# Altium project PCB_Project.PrjPcb
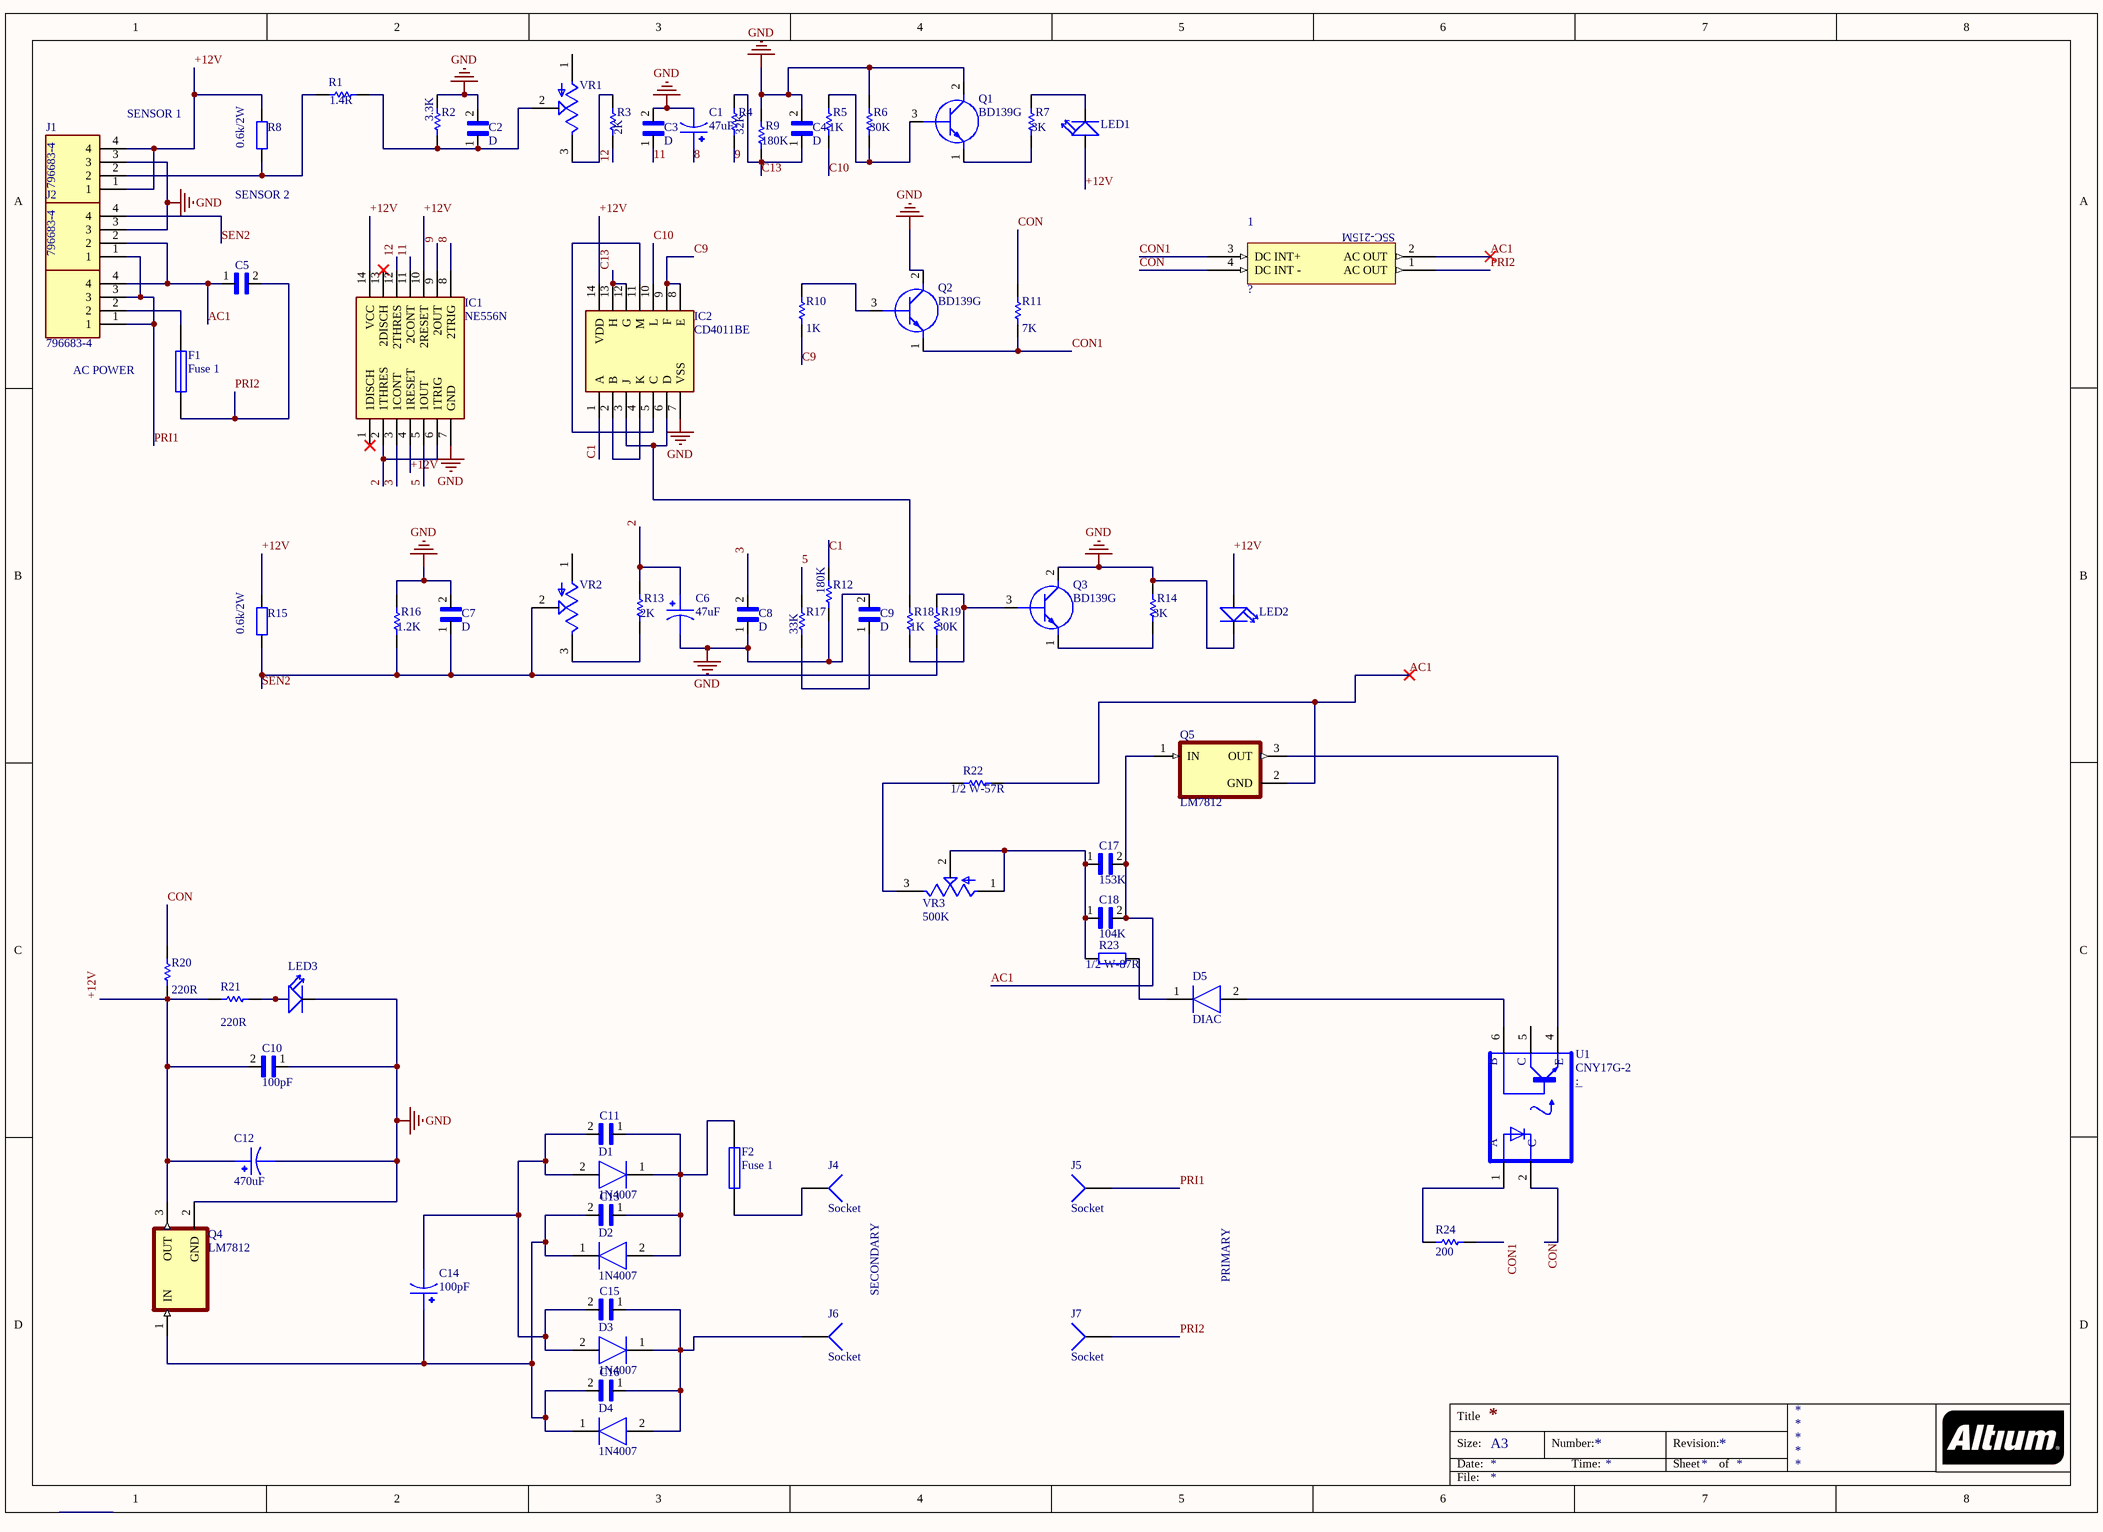
[diagram p0: Sheet1.SchDoc]
1 sheet, 71 parts. Net scope: global (net labels, ports and power ports of the same name join across sheets).
Board file: PCB1.PcbDoc

## Sheet Sheet1.SchDoc
size A3

### Parts
1  ?  [PCBComponent_1]
C1  47uF  [CAPPRD500W60D1330H2700]
C2  D  [CAP_DE21XSA100KN3AY02F]
C3  D  [CAP_DE21XSA100KN3AY02F]
C4  D  [CAP_DE21XSA100KN3AY02F]
C5  (no value)  [CAP_DE21XSA100KN3AY02F]
C6  47uF  [CAPPRD500W60D1330H2700]
C7  D  [CAP_DE21XSA100KN3AY02F]
C8  D  [CAP_DE21XSA100KN3AY02F]
C9  D  [CAP_DE21XSA100KN3AY02F]
C10  100pF  [CAP_DE21XSA100KN3AY02F]
C11  (no value)  [CAP_DE21XSA100KN3AY02F]
C12  470uF  [CAPPRD500W60D1330H2700]
C13  (no value)  [CAP_DE21XSA100KN3AY02F]
C14  100pF  [CAPPRD500W60D1330H2700]
C15  (no value)  [CAP_DE21XSA100KN3AY02F]
C16  (no value)  [CAP_DE21XSA100KN3AY02F]
C17  153K  [CAP_DE21XSA100KN3AY02F]
C18  104K  [CAP_DE21XSA100KN3AY02F]
D1  1N4007  [DIOAD1138W56L406D183]
D2  1N4007  [DIOAD1138W56L406D183]
D3  1N4007  [DIOAD1138W56L406D183]
D4  1N4007  [DIOAD1138W56L406D183]
D5  DIAC  [DIOAD1138W56L406D183]
F1  Fuse 1  [PIN-W2/E2.8]
F2  Fuse 1  [PIN-W2/E2.8]
IC1  NE556N  [DIP794W53P254L1930H508Q14N]
IC2  CD4011BE  [DIP794W53P254L1930H508Q14N]
J1  796683-4  [TE_796683-4]
J2  796683-4  [TE_796683-4]
J3  796683-4  [TE_796683-4]
J4  Socket  [PIN1]
J5  Socket  [PIN1]
J6  Socket  [PIN1]
J7  Socket  [PIN1]
LED1  (no value)  [LED2-2.54-D10MM]
LED2  (no value)  [LED2-2.54-D10MM]
LED3  (no value)  [LED2-2.54-D10MM]
Q1  BD139G  [TO229P300X760X1364-3P]
Q2  BD139G  [TO229P300X760X1364-3P]
Q3  BD139G  [TO229P300X760X1364-3P]
Q4  LM7812  [TO254P1054X470X2600-3]
Q5  LM7812  [TO254P1054X470X2600-3]
R1  value 1.4R  [AXIAL-0.5]
R2  value 3.3K  [AXIAL-0.5]
R3  value 2K  [AXIAL-0.5]
R4  value 32K  [AXIAL-0.5]
R5  value 1K  [AXIAL-0.5]
R6  value 30K  [AXIAL-0.5]
R7  value 3K  [AXIAL-0.5]
R8  value 0.6k/2W  [AXIAL-0.4]
R9  value 180K  [AXIAL-0.5]
R10  value 1K  [AXIAL-0.5]
R11  value 7K  [AXIAL-0.5]
R12  value 180K  [AXIAL-0.5]
R13  value 2K  [AXIAL-0.5]
R14  value 3K  [AXIAL-0.5]
R15  value 0.6k/2W  [AXIAL-0.4]
R16  value 1.2K  [AXIAL-0.5]
R17  value 33K  [AXIAL-0.5]
R18  value 1K  [AXIAL-0.5]
R19  value 30K  [AXIAL-0.5]
R20  value 220R  [AXIAL-0.5]
R21  value 220R  [AXIAL-0.5]
R22  value 1/2 W-57R  [AXIAL-0.5]
R23  value 1/2 W-87R  [AXIAL-0.4]
R24  value 200  [AXIAL-0.5]
U1  CNY17G-2  [DIP762W50P254L730H410Q6]
VR1  (no value)  [TRIM_3362P-1-105]
VR2  (no value)  [TRIM_3362P-1-105]
VR3  500K  [TRIM_3362P-1-105]

### Nets
GND: C1.2 C2.2 C3.2 C4.2 C6.2 C7.2 C8.1 C9.2 C10.1 C12.2 IC1.7(GND) IC2.7(VSS) J1.3 J2.3 LED2.NEG LED3.NEG Q1.2(C) Q2.2(C) Q3.2(C) Q4.2(GND) R2.2 R6.2 R9.2 R12.1 R14.2 R16.2
2: C6.1 IC1.2(1THRES) IC1.6(1TRIG) R13.2
3: C8.2 IC1.3(1CONT)
5: IC1.5(1OUT) R17.2
8: C1.1 IC1.8(2TRIG)
9: IC1.9(2OUT) R4.1
11: C3.1 IC1.11(2CONT)
12: IC1.12(2THRES) R3.1
+12V: C10.2 C12.1 IC1.4(1RESET) IC1.10(2RESET) IC1.14(VCC) IC2.14(VDD) J1.1 J1.4 LED1.POS LED2.POS Q4.3(OUT) R8.2 R15.2 R20.2 R21.2
AC1: 1.2(AC_OUT) C5.1 C17.2 C18.2 J2.2 J3.4 Q5.1(IN) Q5.2(GND) R22.2
C1: IC2.1(A) R12.2
C9: IC2.8(E) IC2.9(F) R10.1
C10: IC2.10(L) R5.1
C13: C4.1 IC2.12(G) IC2.13(H) R4.2 R9.1
CON: 1.4(DC_INT_-) R11.2 R20.1 U1.2(C)
CON1: 1.3(DC_INT+) Q2.1(E) R11.1 R24.1
PRI1: J2.1 J3.1 J3.3 J5.1
PRI2: 1.1(AC_OUT) C5.2 F1.1 J7.1
SEN2: C7.1 J2.4 R15.1 R16.1 R19.1 VR2.2(WIPER)
NetC2_1: C2.1 R1.2 R2.1 VR1.2(WIPER)
NetC9_1: C9.1 R17.1
NetC11_1: C11.1 C13.1 D1.1(K) D2.2(A) F2.2
NetC11_2: C11.2 C14.2 C15.2 D1.2(A) D3.2(A)
NetC13_2: C13.2 C14.1 C16.2 D2.1(K) D4.1(K) Q4.1(IN)
NetC15_1: C15.1 C16.1 D3.1(K) D4.2(A) J6.1
NetC17_1: C17.1 C18.1 R23.1 VR3.1(CCW) VR3.2(WIPER)
NetD5_1: D5.1(K) R23.2
NetD5_2: D5.2(A) U1.6(B)
NetF1_2: F1.2 J3.2
NetF2_1: F2.1 J4.1
NetIC2_2: IC2.2(B) IC2.4(K)
NetIC2_3: IC2.3(J) IC2.6(D) R18.2
NetIC2_5: IC2.5(C) IC2.11(M)
NetJ1_2: J1.2 R1.1 R8.1
NetLED1_NEG: LED1.NEG R7.2
NetLED3_POS: LED3.POS R21.1
NetQ1_1: Q1.1(E) R7.1
NetQ1_3: Q1.3(B) R5.2 R6.1
NetQ2_3: Q2.3(B) R10.2
NetQ3_1: Q3.1(E) R14.1
NetQ3_3: Q3.3(B) R18.1 R19.2
NetQ5_3: Q5.3(OUT) U1.4(E)
NetR3_2: R3.2 VR1.3(CW)
NetR13_1: R13.1 VR2.3(CW)
NetR22_1: R22.1 VR3.3(CW)
NetR24_2: R24.2 U1.1(A)

Not connected (* = marked no-connect by the designer): IC1 1(1DISCH)* 13(2DISCH)*; U1 5(C`); VR1 1(CCW); VR2 1(CCW)

### Notes on the sheet
- (near J1) SENSOR 1
- (near R8) SENSOR 2
- AC POWER
- SECONDARY
- PRIMARY
- Title
- Size:
- Date:
- A3
- Number:
- Time:
- Revision:
- Sheet
- of
- File:
- (in symbol Component_1) S5C-215M

### Library data of the parts
1 = Component_1
C1 C6 C12 C14 = 478CKS010M: 4700ÂµF 10V Aluminum Electrolytic Capacitors Radial, Can 98.8mOhm @ 120Hz 2000 Hrs @ 85Â°C; MF: Illinois Capacitor; MP: 478CKS010M; SnapEDA_Link: https://www.snapeda.com/parts/478CKS010M/Illinois%20Capacitor/view-part/2347563/?ref=snap; Price: None; Mouser-Purchase-URL: https://snapeda.com/shop?store=Mouser&id=2347563; Availability: Warning; Package: Radial Illinois Capacitor; Value: *
C2-C5 C7-C11 C13 C15-C18 = DE21XSA100KN3AY02F: Package: None; Price: None; Value: *; MP: DE21XSA100KN3AY02F; Availability: Unavailable
D1-D5 = 1N4678__DO35_: Diode; Manufacturer_Name: Microsemi Corporation; Manufacturer_Part_Number: 1N4678 (DO35); Datasheet Link: https://www.microsemi.com/document-portal/doc_download/5827-1n4678-4717-datasheet
F1 F2 = Fuse 1: Fuse; Published: 8-Jun-2000; LatestRevisionDate: 17-Jul-2002; LatestRevisionNote: Re-released for DXP Platform.; PackageReference: PIN-W2/E2.8; Publisher: Altium Limited; PackageDescription: Thru-Hole; 2 Leads
IC1 = NE556N: Integrated Circuit; Manufacturer_Name: Texas Instruments; Datasheet Link: http://www.ti.com/lit/gpn/ne556; Height: 5.08mm; Manufacturer_Part_Number: NE556N; Mouser Part Number: 595-NE556N; Mouser Price/Stock: https://www.mouser.co.uk/ProductDetail/Texas-Instruments/NE556N/?qs=gb35HGp1gQKUkn%252B6zgU6RA%3D%3D; Arrow Part Number: NE556N; Arrow Price/Stock: https://www.arrow.com/en/products/ne556n/texas-instruments
IC2 = CD4011BE: Integrated Circuit; Manufacturer_Name: Texas Instruments; Datasheet Link: http://www.ti.com/lit/ds/symlink/cd4011b.pdf; Height: 5.08mm; Manufacturer_Part_Number: CD4011BE; Mouser Part Number: 595-CD4011BE; Mouser Price/Stock: https://www.mouser.co.uk/ProductDetail/Texas-Instruments/CD4011BE/?qs=st7IWvlL5%2FgbunuzXw39Lg%3D%3D; Arrow Part Number: CD4011BE; Arrow Price/Stock: https://www.arrow.com/en/products/cd4011be/texas-instruments
J1-J3 = 796683-4: TERMI-BLOK PCB MOUNT 90 4P.; MF: TE Connectivity; Price: None; Value: *; EU_RoHS_Compliance: Compliant with Exemptions; MP: 796683-4; Package: None; TE_purchase_URL: https://www.te.com/usa-en/product-796683-4.html?te_bu=Cor&te_type=disp&te_campaign=seda_glo_cor-seda-global-disp-prtnr-fy19-seda-model-bom-cta_sma-317_1&elqCampaignId=32493; SnapEDA_Link: https://www.snapeda.com/parts/796683-4/TE%20Connectivity/view-part/2375703/?ref=snap; Availability: Unavailable
LED1-LED3 = DIP-LED-GREEN-VAPOROUS-GREEN-10MM(2P-D10MM): DIP LED Green-Vaporous Green-10mm; MF: Chengguangxing; MP: G1004DC; Package: None; Value: *; SnapEDA_Link: https://www.snapeda.com/parts/G1004DC/Chengguangxing/view-part/106403/?ref=snap; Availability: Unavailable; Price: None
Q1-Q3 = BD139G: Transistor BJT NPN; Manufacturer_Name: ON Semiconductor; Datasheet Link: http://www.onsemi.com/pub/Collateral/BD135-D.PDF; Height: 3mm; Manufacturer_Part_Number: BD139G; Mouser Part Number: 863-BD139G; Mouser Price/Stock: https://www.mouser.co.uk/ProductDetail/ON-Semiconductor/BD139G?qs=vNc2DXHODiLIqGggNMT6cg%3D%3D; Arrow Part Number: BD139G; Arrow Price/Stock: https://www.arrow.com/en/products/bd139g/on-semiconductor
Q4 Q5 = LM7805CT/NOPB: Linear Voltage Regulator IC 1 Output 1A TO-220-3; MF: ON Semiconductor; MP: LM7805CT; SnapEDA_Link: https://www.snapeda.com/parts/LM7805CT/ON%20Semiconductor/view-part/546231/?ref=snap; Price: None; Package: TO-220 ON Semiconductor; Value: *; Availability: Unavailable
R1-R7 R9-R14 R16-R22 R24 = Res Semi: Semiconductor Resistor; Published: 8-Jun-2000; LatestRevisionDate: 17-Jul-2002; LatestRevisionNote: Re-released for DXP Platform.; PackageReference: AXIAL-0.5; Publisher: Altium Limited; PackageDescription: Axial Device, Thru-Hole; 2 Leads; 0.5 in Pin Spacing
R8 R15 R23 = Res2: Resistor; Published: 8-Jun-2000; LatestRevisionDate: 17-Jul-2002; LatestRevisionNote: Re-released for DXP Platform.; PackageReference: AXIAL-0.4; Publisher: Altium Limited; PackageDescription: Axial Device, Thru-Hole; 2 Leads; 0.4 in Pin Spacing
U1 = CNY17G-2: Optoisolator Transistor with Base Output 5000Vrms 1 Channel 6-DIP; MF: Vishay; Value: *; Package: DIP-6 Vishay; Purchase-URL: https://pricing.snapeda.com/search/part/CNY17G-2/?ref=eda; MP: CNY17G-2; Price: None; SnapEDA_Link: https://www.snapeda.com/parts/CNY17G-2/Vishay%20Semiconductor%20Opto%20Division/view-part/1187629/?ref=snap; Availability: Good
VR1-VR3 = 3362P-1-105: 1 MOhms 0.5W, 1/2W PC Pins Through Hole Trimmer Potentiometer Cermet 1 Turn Top Adjustment; MF: Bourns; Value: *; Availability: Warning; SnapEDA_Link: https://www.snapeda.com/parts/3362P-1-105/Bourns/view-part/1463271/?ref=snap; Check_prices: https://www.snapeda.com/parts/3362P-1-105/Bourns/view-part/1463271/?ref=eda; Package: 3116 Bourns; Purchase-URL: https://pricing.snapeda.com/search/part/3362P-1-105/?ref=eda; MP: 3362P-1-105; Price: None
J4-J7 = Socket: LatestRevisionDate: 17-Jul-2002; LatestRevisionNote: Re-released for DXP Platform.; Publisher: Altium Limited